# EasyEDA Pro project BLE2.eprj

# Schematic Schematic1
Board Name: Board1; Create Date: 2025-10-14; Page Name: P1; Project Name: BLE2; Schematic Name: Schematic1; Update Date: 2025-10-14; Company: 嘉立创EDA; Page Size: A4; Version: V1.0
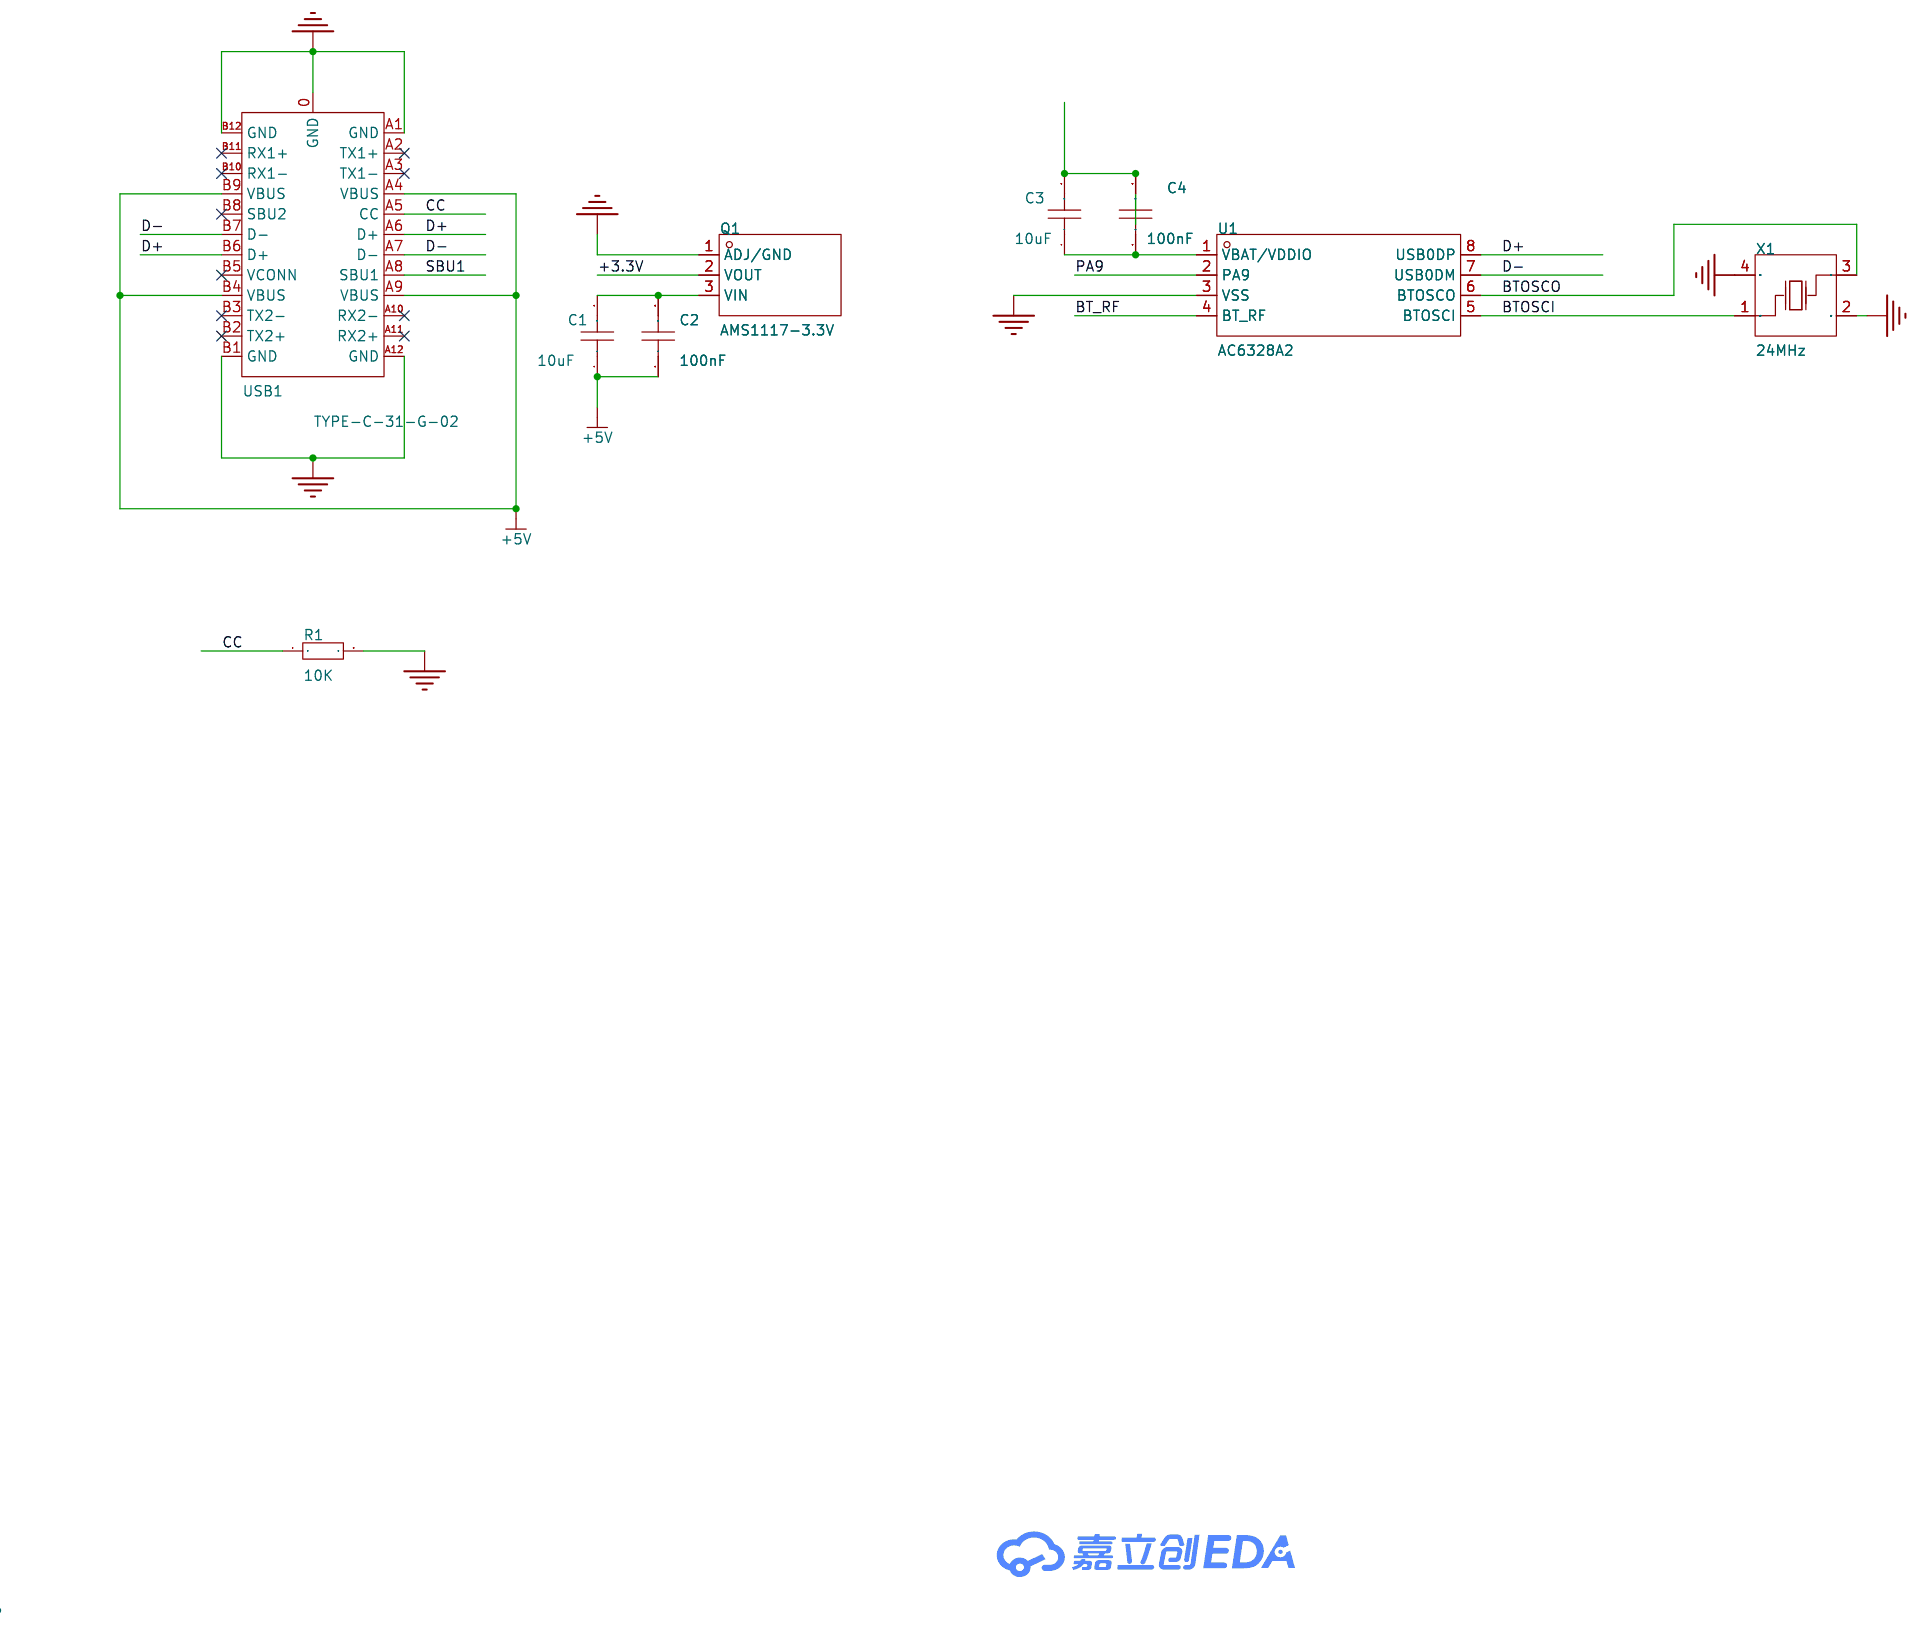
[diagram p0: schematic sheet]

## Parts
C1  10uF  [C0402]
C2  100nF  [C0402]
C3  10uF  [C0402]
C4  100nF  [C0402]
Q1  AMS1117-3.3V  [SOT-89-3_L4.5-W2.5-P1.50-LS4.2-BR]
R1  10K  [R0402]
U1  AC6328A2  [SOP-8_L4.9-W3.9-P1.27-LS6.0-BL]
USB1  TYPE-C-31-G-02  [USB-C-SMD_TYPE-C-31-G-02]
X1  24MHz  [CRYSTAL-SMD_4P-L3.2-W2.5-BL]

## Library data of the parts
C1-C4 = CAP_0402: Supplier Footprint: 0402
Q1 = AMS1117-3.3V_C5120796: 输出类型:固定;工作电压:18V;输出电压:3.3V;输出电流:1A;输出极性:正极;; LCSC Part Name: 输入18V 输出3.3V 1A; Supplier Part: C5120796; Manufacturer: MSKSEMI(美森科); Supplier Footprint: SOT-89; JLCPCB Part Class: 扩展库; Datasheet: https://item.szlcsc.com/datasheet/AMS1117-3.3V/5706251.html; Supplier: LCSC; Output Type: 固定; Voltage - Supply: 18V; Output Voltage: 3.3V; Output Current: 1A; Voltage Dropout: 1.4V@(1A); standby current: 12mA; Operating Temperature: 0℃~+125℃; Output Configuration: 正极; Number of Outputs: 1
R1 = Res_0402: Supplier Footprint: 0402
U1 = AC6328A2: Supplier Part: C5440080; Manufacturer: JL(杰理); Supplier Footprint: SOP-8; JLCPCB Part Class: 扩展库; Datasheet: https://atta.szlcsc.com/upload/public/pdf/source/20230327/498F5A24E1A7D4AE60F3EC0FBC1B9888.pdf; Supplier: LCSC
USB1 = TYPE-C-31-G-02: 连接器类型:Type-C;协议标准:-;公母:公;安装方式:夹板;触点数量:24P;端口数量:1;额定电流 - 电源:-;工作温度:-55℃~+85℃;; LCSC Part Name: Type-C 公 夹板; Supplier Part: C530606; Manufacturer: 韩国韩荣; Supplier Footprint: SMD; JLCPCB Part Class: 扩展库; Datasheet: https://item.szlcsc.com/datasheet/TYPE-C-31-G-02/550940.html; Supplier: LCSC; Connector Type: Type-C; Gender: 公; Mounting Type: 夹板; Number of Contacts: 24P; Number of Ports: 1; Operating Temperature: -55℃~+85℃
X1 = X322524MOB4SI: 晶振类型:贴片晶振;频率:24MHz;常温频差:±10ppm;负载电容:12pF;频率稳定度:±20ppm;; LCSC Part Name: YSX321SL 24MHZ 4P 3225 12PF ±10PPM -40~85℃ (±20PPM); Supplier Part: C70590; Manufacturer: YXC(扬兴晶振); Supplier Footprint: SMD3225-4P; JLCPCB Part Class: 扩展库; Datasheet: https://item.szlcsc.com/datasheet/X322524MOB4SI/71688.html; Supplier: LCSC; Type: 贴片晶振; Normal temperature Frequency Tolerance: ±10ppm; Load Capacitance: 12pF; Frequency Stability: ±20ppm; Operating Temperature: -40℃~+85℃

## Nets
+3.3V: Q1.2(VOUT)
+5V: C1.1 C2.1 USB1.A4(VBUS) USB1.A9(VBUS) USB1.B4(VBUS) USB1.B9(VBUS)
GND: Q1.1(ADJ/GND) R1.2 U1.3(VSS) USB1.0(GND) USB1.A1(GND) USB1.A12(GND) USB1.B1(GND) USB1.B12(GND) X1.2(GND) X1.4(GND)
BT_RF: U1.4(BT_RF)
BTOSCI: U1.5(BTOSCI) X1.1(OSC1)
BTOSCO: U1.6(BTOSCO) X1.3(OSC2)
CC: R1.1 USB1.A5(CC)
D+: U1.8(USB0DP) USB1.A6(D+) USB1.B6(D+)
D-: U1.7(USB0DM) USB1.A7(D-) USB1.B7(D-)
PA9: U1.2(PA9)
SBU1: USB1.A8(SBU1)
$1N1981: C1.2 C2.2 Q1.3(VIN)
$1N2136: C3.1 C4.1 U1.1(VBAT/VDDIO)
$1N2155: C3.2 C4.2

Not connected (* = marked no-connect by the designer): USB1 A2(TX1+)* A3(TX1-)* A10(RX2-)* A11(RX2+)* B2(TX2+)* B3(TX2-)* B5(VCONN)* B8(SBU2)* B10(RX1-)* B11(RX1+)*

# Board PCB1
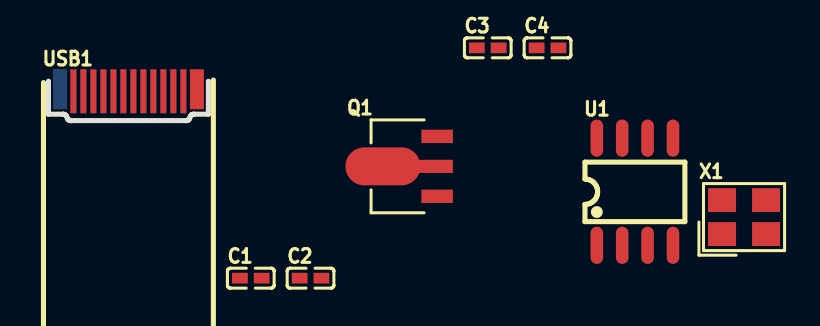
[diagram p1: board, top side]
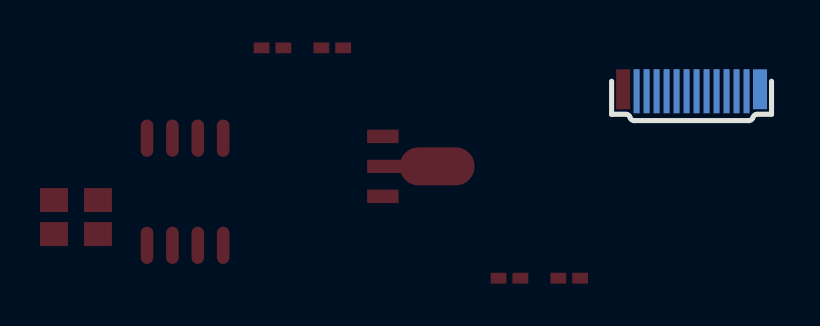
[diagram p2: board, bottom side, seen from below]

Outline 8 x 1.97 mm; copper layers: Top Layer, Bottom Layer. Coordinates in mm from the lower left corner of the outline.
Stack: Top Layer 0.035mm / Dielectric1 1.51mm FR4 er 4.5 / Bottom Layer 0.035mm

## Design rules (mm)
template: JLCPCB Capability(Two Layers Board)
spacing copperThickness1oz (default): track to track 0.102, other pairs 0.152 to 0.3
spacing copperThickness2oz: track to track 0.203, other pairs 0.152 to 0.3
track width copperThickness1oz (default): min 0.127, default 0.254, max 2.54
track width copperThickness2oz: min 0.203, default 0.254, max 2.54
differential pair differentialPair (default): width min 0.127, default 0.254, max 2.54; gap min 0.152, default 0.152
via viaSize (default): diameter min 0.5, default 0.61, max 10; hole min 0.3, default 0.305, max 6.3

## Placement (name value [footprint] x y rotation side)
C1  10uF  [C0402]  10.12 -7.89 0 top
C2  100nF  [C0402]  13.11 -7.89 0 top
C3  10uF  [C0402]  21.98 3.64 0 top
C4  100nF  [C0402]  24.97 3.64 0 top
Q1  AMS1117-3.3V  [SOT-89-3_L4.5-W2.5-P1.50-LS4.2-BR]  18.09 -2.29 0 top
U1  AC6328A2  [SOP-8_L4.9-W3.9-P1.27-LS6.0-BL]  29.34 -3.56 0 top
USB1  TYPE-C-31-G-02  [USB-C-SMD_TYPE-C-31-G-02]  4 1.52 0 top
X1  24MHz  [CRYSTAL-SMD_4P-L3.2-W2.5-BL]  34.8 -4.83 0 top

## Footprints (pads in the part's own frame, mm; a bottom-side part is the same pattern mirrored in y, then rotated)
C0402
  rect 0.79x0.54 smd: 1(-0.545,0) 2(0.545,0)
CRYSTAL-SMD_4P-L3.2-W2.5-BL
  rect 1.4x1.2 smd: 1(-1.1,-0.85) 2(1.1,-0.85) 3(1.1,0.85) 4(-1.1,0.85)
SOP-8_L4.9-W3.9-P1.27-LS6.0-BL
  oval 0.63x1.865 smd: 1(-1.905,-2.683) 2(-0.635,-2.683) 3(0.635,-2.683) 4(1.905,-2.683) 5(1.905,2.683) 6(0.635,2.683) 7(-0.635,2.683) 8(-1.905,2.683)
SOT-89-3_L4.5-W2.5-P1.50-LS4.2-BR
  rect 1.575x0.672 smd: 1(1.356,-1.5) 3(1.356,1.5)
  custom 5.377x1.9 smd: 2(-1.356,0)
USB-C-SMD_TYPE-C-31-G-02
  rect 0.7x2 smd far side: 0(-3.425,0.05)
  rect 0.7x2 smd: 0(3.425,0.05)
  rect 0.3x2.2 smd: A1(2.75,-0.05) A2(2.25,-0.05) A3(1.75,-0.05) A4(1.25,-0.05) A5(0.75,-0.05) A6(0.25,-0.05) A7(-0.25,-0.05) A8(-0.75,-0.05) A9(-1.25,-0.05) A10(-1.75,-0.05) A11(-2.25,-0.05) A12(-2.75,-0.05)
  rect 0.3x2.2 smd far side: B1(-2.75,-0.05) B2(-2.25,-0.05) B3(-1.75,-0.05) B4(-1.25,-0.05) B5(-0.75,-0.05) B6(-0.25,-0.05) B7(0.25,-0.05) B8(0.75,-0.05) B9(1.25,-0.05) B10(1.75,-0.05) B11(2.25,-0.05) B12(2.75,-0.05)

## Nets
As in the schematic, except:
+5V: USB1.A4
VBUS: USB1.A9 USB1.B4 USB1.B9
D+: USB1.A6 USB1.B6
D-: USB1.A7 USB1.B7
$1N2068: C1.1 C2.1
